# EAGLE schematic BBB-cape-basic-v01 (EAGLE 6.4)
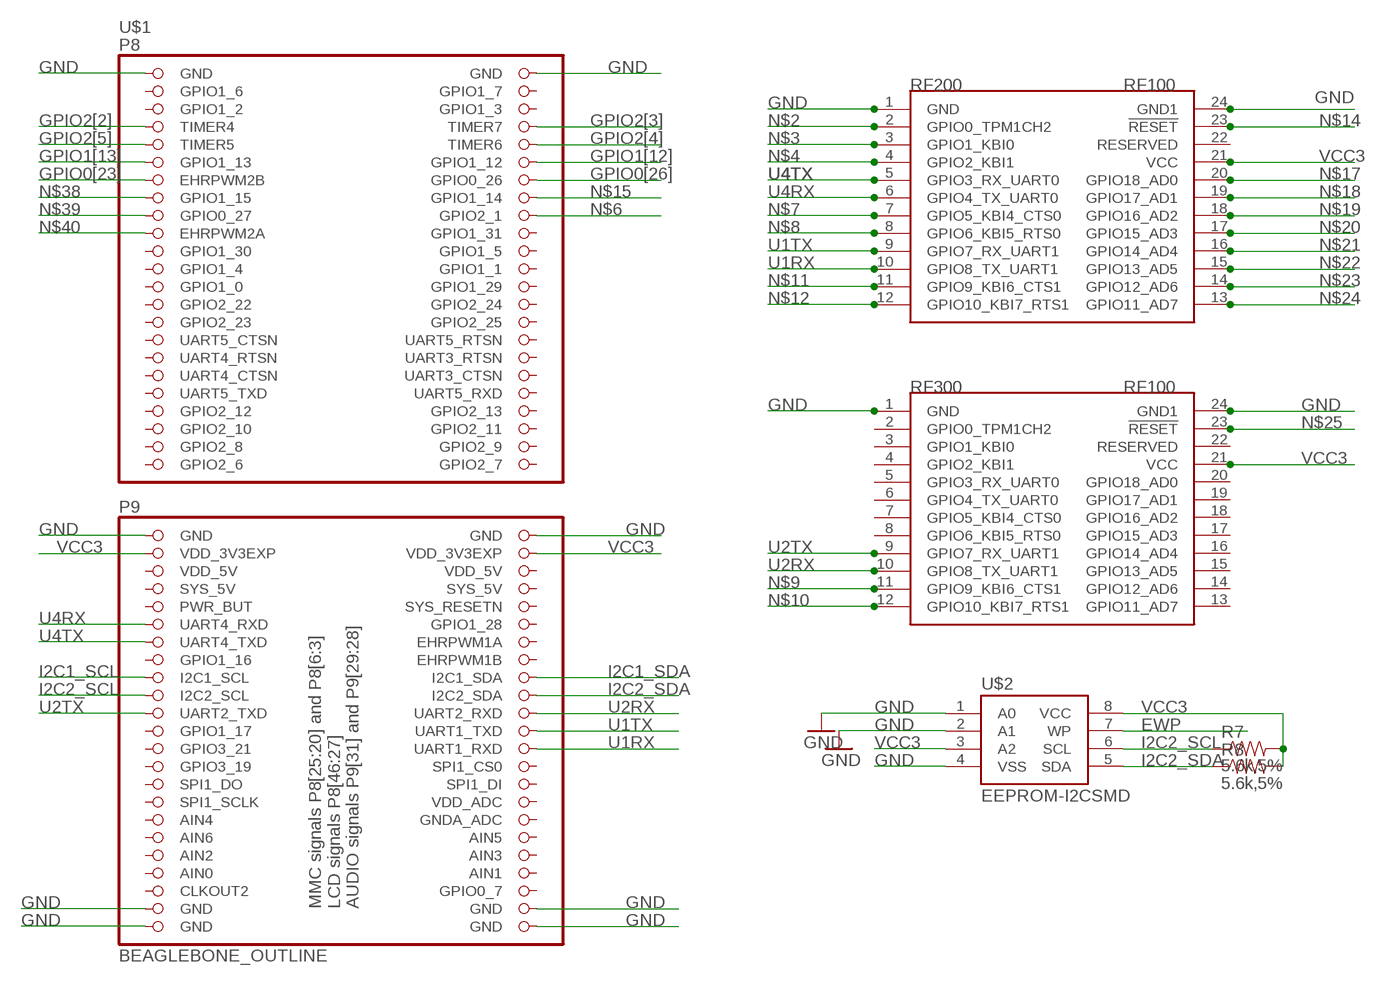
[diagram p0: schematic, sheet 1]

## Parts
R7  5.6k,5%  RESISTOR0805-RES  [0805]
R8  5.6k,5%  RESISTOR0805-RES  [0805]
RF200  rf200  RF100-JACKJACK2  [SYNAPSERFENGINE-THM-SMT-JACK2]
RF300  rf300  RF100-JACKJACK2  [SYNAPSERFENGINE-THM-SMT-JACK2]
U$1  BEAGLEBONE_OUTLINE  [BEAGLEBONE_SHIELD]
U$2  EEPROM-I2CSMD  [SO08]

## Nets
EWP: U$2.7(WP)
GND: RF200.1(GND) RF200.24(GND1) RF200.P1 RF200.P24 RF200.P201 RF200.P224 RF300.1(GND) RF300.24(GND1) RF300.P1 RF300.P24 RF300.P201 RF300.P224 U$1.1(GND) U$1.2(GND) U$1.47(GND) U$1.48(GND) U$1.89(GND) U$1.90(GND) U$1.91(GND) U$1.92(GND) U$2.1(A0) U$2.2(A1) U$2.4(VSS)
GPIO0[23]: U$1.13(EHRPWM2B)
GPIO0[26]: U$1.14(GPIO0_26)
GPIO1[12]: U$1.12(GPIO1_12)
GPIO1[13]: U$1.11(GPIO1_13)
GPIO2[2]: U$1.7(TIMER4)
GPIO2[3]: U$1.8(TIMER7)
GPIO2[4]: U$1.10(TIMER6)
GPIO2[5]: U$1.9(TIMER5)
I2C1_SCL: U$1.63(I2C1_SCL)
I2C1_SDA: U$1.64(I2C1_SDA)
I2C2_SCL: R7.1 U$1.65(I2C2_SCL) U$2.6(SCL)
I2C2_SDA: R8.1 U$1.66(I2C2_SDA) U$2.5(SDA)
N$2: RF200.2(GPIO0_TPM1CH2) RF200.P2 RF200.P202
N$3: RF200.3(GPIO1_KBI0) RF200.P3 RF200.P203
N$4: RF200.4(GPIO2_KBI1) RF200.P4 RF200.P204
N$6: U$1.18(GPIO2_1)
N$7: RF200.7(GPIO5_KBI4_CTS0) RF200.P7 RF200.P207
N$8: RF200.8(GPIO6_KBI5_RTS0) RF200.P8 RF200.P208
N$9: RF300.11(GPIO9_KBI6_CTS1) RF300.P11 RF300.P211
N$10: RF300.12(GPIO10_KBI7_RTS1) RF300.P12 RF300.P212
N$11: RF200.11(GPIO9_KBI6_CTS1) RF200.P11 RF200.P211
N$12: RF200.12(GPIO10_KBI7_RTS1) RF200.P12 RF200.P212
N$14: RF200.23(!RESET) RF200.P23 RF200.P223
N$15: U$1.16(GPIO1_14)
N$17: RF200.20(GPIO18_AD0) RF200.P20 RF200.P220
N$18: RF200.19(GPIO17_AD1) RF200.P19 RF200.P219
N$19: RF200.18(GPIO16_AD2) RF200.P18 RF200.P218
N$20: RF200.17(GPIO15_AD3) RF200.P17 RF200.P217
N$21: RF200.16(GPIO14_AD4) RF200.P16 RF200.P216
N$22: RF200.15(GPIO13_AD5) RF200.P15 RF200.P215
N$23: RF200.14(GPIO12_AD6) RF200.P14 RF200.P214
N$24: RF200.13(GPIO11_AD7) RF200.P13 RF200.P213
N$25: RF300.23(!RESET) RF300.P23 RF300.P223
N$38: U$1.15(GPIO1_15)
N$39: U$1.17(GPIO0_27)
N$40: U$1.19(EHRPWM2A)
U1RX: RF200.10(GPIO8_TX_UART1) RF200.P10 RF200.P210 U$1.72(UART1_RXD)
U1TX: RF200.9(GPIO7_RX_UART1) RF200.P9 RF200.P209 U$1.70(UART1_TXD)
U2RX: RF300.10(GPIO8_TX_UART1) RF300.P10 RF300.P210 U$1.68(UART2_RXD)
U2TX: RF300.9(GPIO7_RX_UART1) RF300.P9 RF300.P209 U$1.67(UART2_TXD)
U4RX: RF200.6(GPIO4_TX_UART0) RF200.P6 RF200.P206 U$1.57(UART4_RXD)
U4TX: RF200.5(GPIO3_RX_UART0) RF200.P5 RF200.P205 U$1.59(UART4_TXD)
VCC3: R7.2 R8.2 RF200.21(VCC) RF200.P21 RF200.P221 RF300.21(VCC) RF300.P21 RF300.P221 U$1.50(VDD_3V3EXP) U$2.3(A2) U$2.8(VCC)
Unconnected: RF200.22(RESERVED) RF200.P22 RF200.P222 RF300.2(GPIO0_TPM1CH2) RF300.3(GPIO1_KBI0) RF300.4(GPIO2_KBI1) RF300.5(GPIO3_RX_UART0) RF300.6(GPIO4_TX_UART0) RF300.7(GPIO5_KBI4_CTS0) RF300.8(GPIO6_KBI5_RTS0) RF300.13(GPIO11_AD7) RF300.14(GPIO12_AD6) RF300.15(GPIO13_AD5) RF300.16(GPIO14_AD4) RF300.17(GPIO15_AD3) RF300.18(GPIO16_AD2) RF300.19(GPIO17_AD1) RF300.20(GPIO18_AD0) RF300.22(RESERVED) RF300.P2 RF300.P3 RF300.P4 RF300.P5 RF300.P6 RF300.P7 RF300.P8 RF300.P13 RF300.P14 RF300.P15 RF300.P16 RF300.P17 RF300.P18 RF300.P19 RF300.P20 RF300.P22 RF300.P202 RF300.P203 RF300.P204 RF300.P205 RF300.P206 RF300.P207 RF300.P208 RF300.P213 RF300.P214 RF300.P215 RF300.P216 RF300.P217 RF300.P218 RF300.P219 RF300.P220 RF300.P222 U$1.3(GPIO1_6) U$1.4(GPIO1_7) U$1.5(GPIO1_2) U$1.6(GPIO1_3) U$1.20(GPIO1_31) U$1.21(GPIO1_30) U$1.22(GPIO1_5) U$1.23(GPIO1_4) U$1.24(GPIO1_1) U$1.25(GPIO1_0) U$1.26(GPIO1_29) U$1.27(GPIO2_22) U$1.28(GPIO2_24) U$1.29(GPIO2_23) U$1.30(GPIO2_25) U$1.31(UART5_CTSN) U$1.32(UART5_RTSN) U$1.33(UART4_RTSN) U$1.34(UART3_RTSN) U$1.35(UART4_CTSN) U$1.36(UART3_CTSN) U$1.37(UART5_TXD) U$1.38(UART5_RXD) U$1.39(GPIO2_12) U$1.40(GPIO2_13) U$1.41(GPIO2_10) U$1.42(GPIO2_11) U$1.43(GPIO2_8) U$1.44(GPIO2_9) U$1.45(GPIO2_6) U$1.46(GPIO2_7) U$1.54(SYS_5V) U$1.55(PWR_BUT) U$1.56(SYS_RESETN) U$1.58(GPIO1_28) U$1.60(EHRPWM1A) U$1.61(GPIO1_16) U$1.62(EHRPWM1B) U$1.69(GPIO1_17) U$1.71(GPIO3_21) U$1.73(GPIO3_19) U$1.74(SPI1_CS0) U$1.75(SPI1_DO) U$1.76(SPI1_DI) U$1.77(SPI1_SCLK) U$1.78(VDD_ADC) U$1.79(AIN4) U$1.80(GNDA_ADC) U$1.81(AIN6) U$1.82(AIN5) U$1.83(AIN2) U$1.84(AIN3) U$1.86(AIN1) U$1.87(CLKOUT2) U$1.88(GPIO0_7)

## Notes on the sheet
- MMC signals P8[25:20] and P8[6:3] 
  LCD signals P8[46:27] 
  AUDIO signals P9[31] and P9[29:28]

## Power pins joined to a net without a drawn wire
AIN0: U$1.85(AIN0)
SYS_5V: U$1.53(SYS_5V)
VDD_3V3EXP: U$1.49(VDD_3V3EXP)
VDD_5V: U$1.51(VDD_5V) U$1.52(VDD_5V)

## Library data of the parts
R7 R8 = SparkFun-Resistors:RESISTOR: Resistor Basic schematic elements and footprints for 0603, 1206, and PTH resistors.
RF200 RF300 = 0_jc-custom-eagle6:RF100-JACK
U$1 = 0_jc-custom-eagle6:BEAGLEBONE_OUTLINE: Should match A3 pinout - but not completely tested
U$2 = 0_jc-custom-eagle6:EEPROM-I2C

## Net classes
0 default: width 0.254 mm, clearance 0.355 mm
1 power: width 0.508 mm
2 smallsig: width 0.152 mm